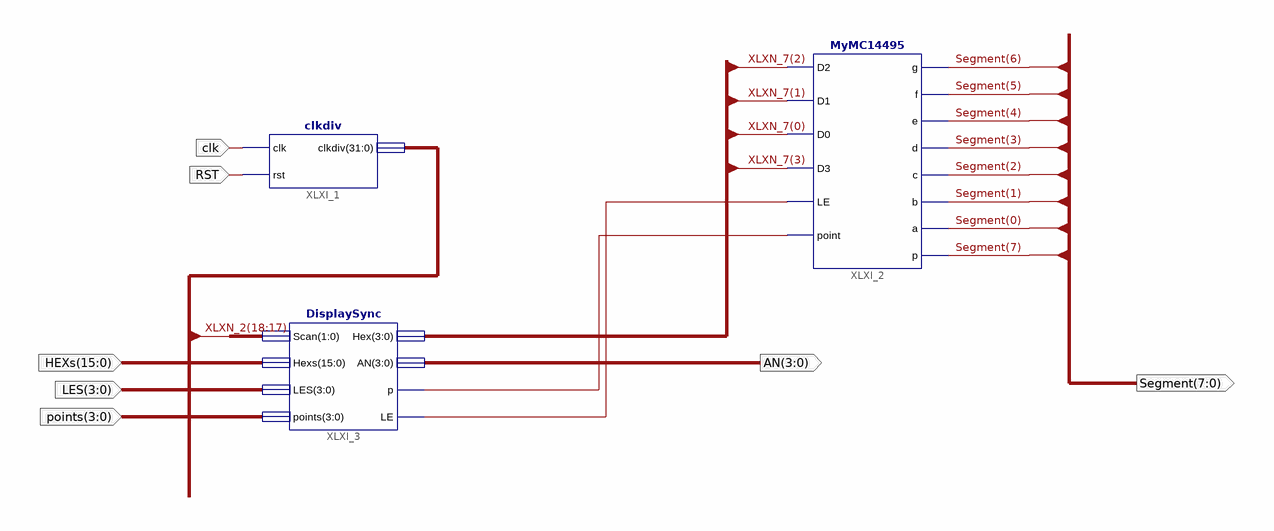
[diagram p0: schematic sheet 1]
// Xilinx ISE schematic DispNum.sch (kintex7) as structural Verilog: 3 symbols, 7 ports
module DispNum (
  input  clk,
  input  RST,
  input  [15:0] HEXs,
  input  [3:0] LES,
  input  [3:0] points,
  output [7:0] Segment,
  output [3:0] AN
);

  wire XLXN_12, XLXN_13;
  wire [3:0] XLXN_7;
  wire [31:0] XLXN_2;

  clkdiv XLXI_1 (.clk(clk), .rst(RST), .clkdiv(XLXN_2));
  MyMC14495 XLXI_2 (
    .D2(XLXN_7[2]), .D1(XLXN_7[1]), .D0(XLXN_7[0]), .D3(XLXN_7[3]), .LE(XLXN_12), .point(XLXN_13),
    .g(Segment[6]), .f(Segment[5]), .e(Segment[4]), .d(Segment[3]), .c(Segment[2]), .b(Segment[1]),
    .a(Segment[0]), .p(Segment[7]));
  DisplaySync XLXI_3 (
    .Scan(XLXN_2[18:17]), .Hexs(HEXs), .LES(LES), .points(points), .Hex(XLXN_7), .AN(AN), .p(XLXN_13),
    .LE(XLXN_12));
endmodule
